# Altium project NODEBOX-RF868.PrjPcb
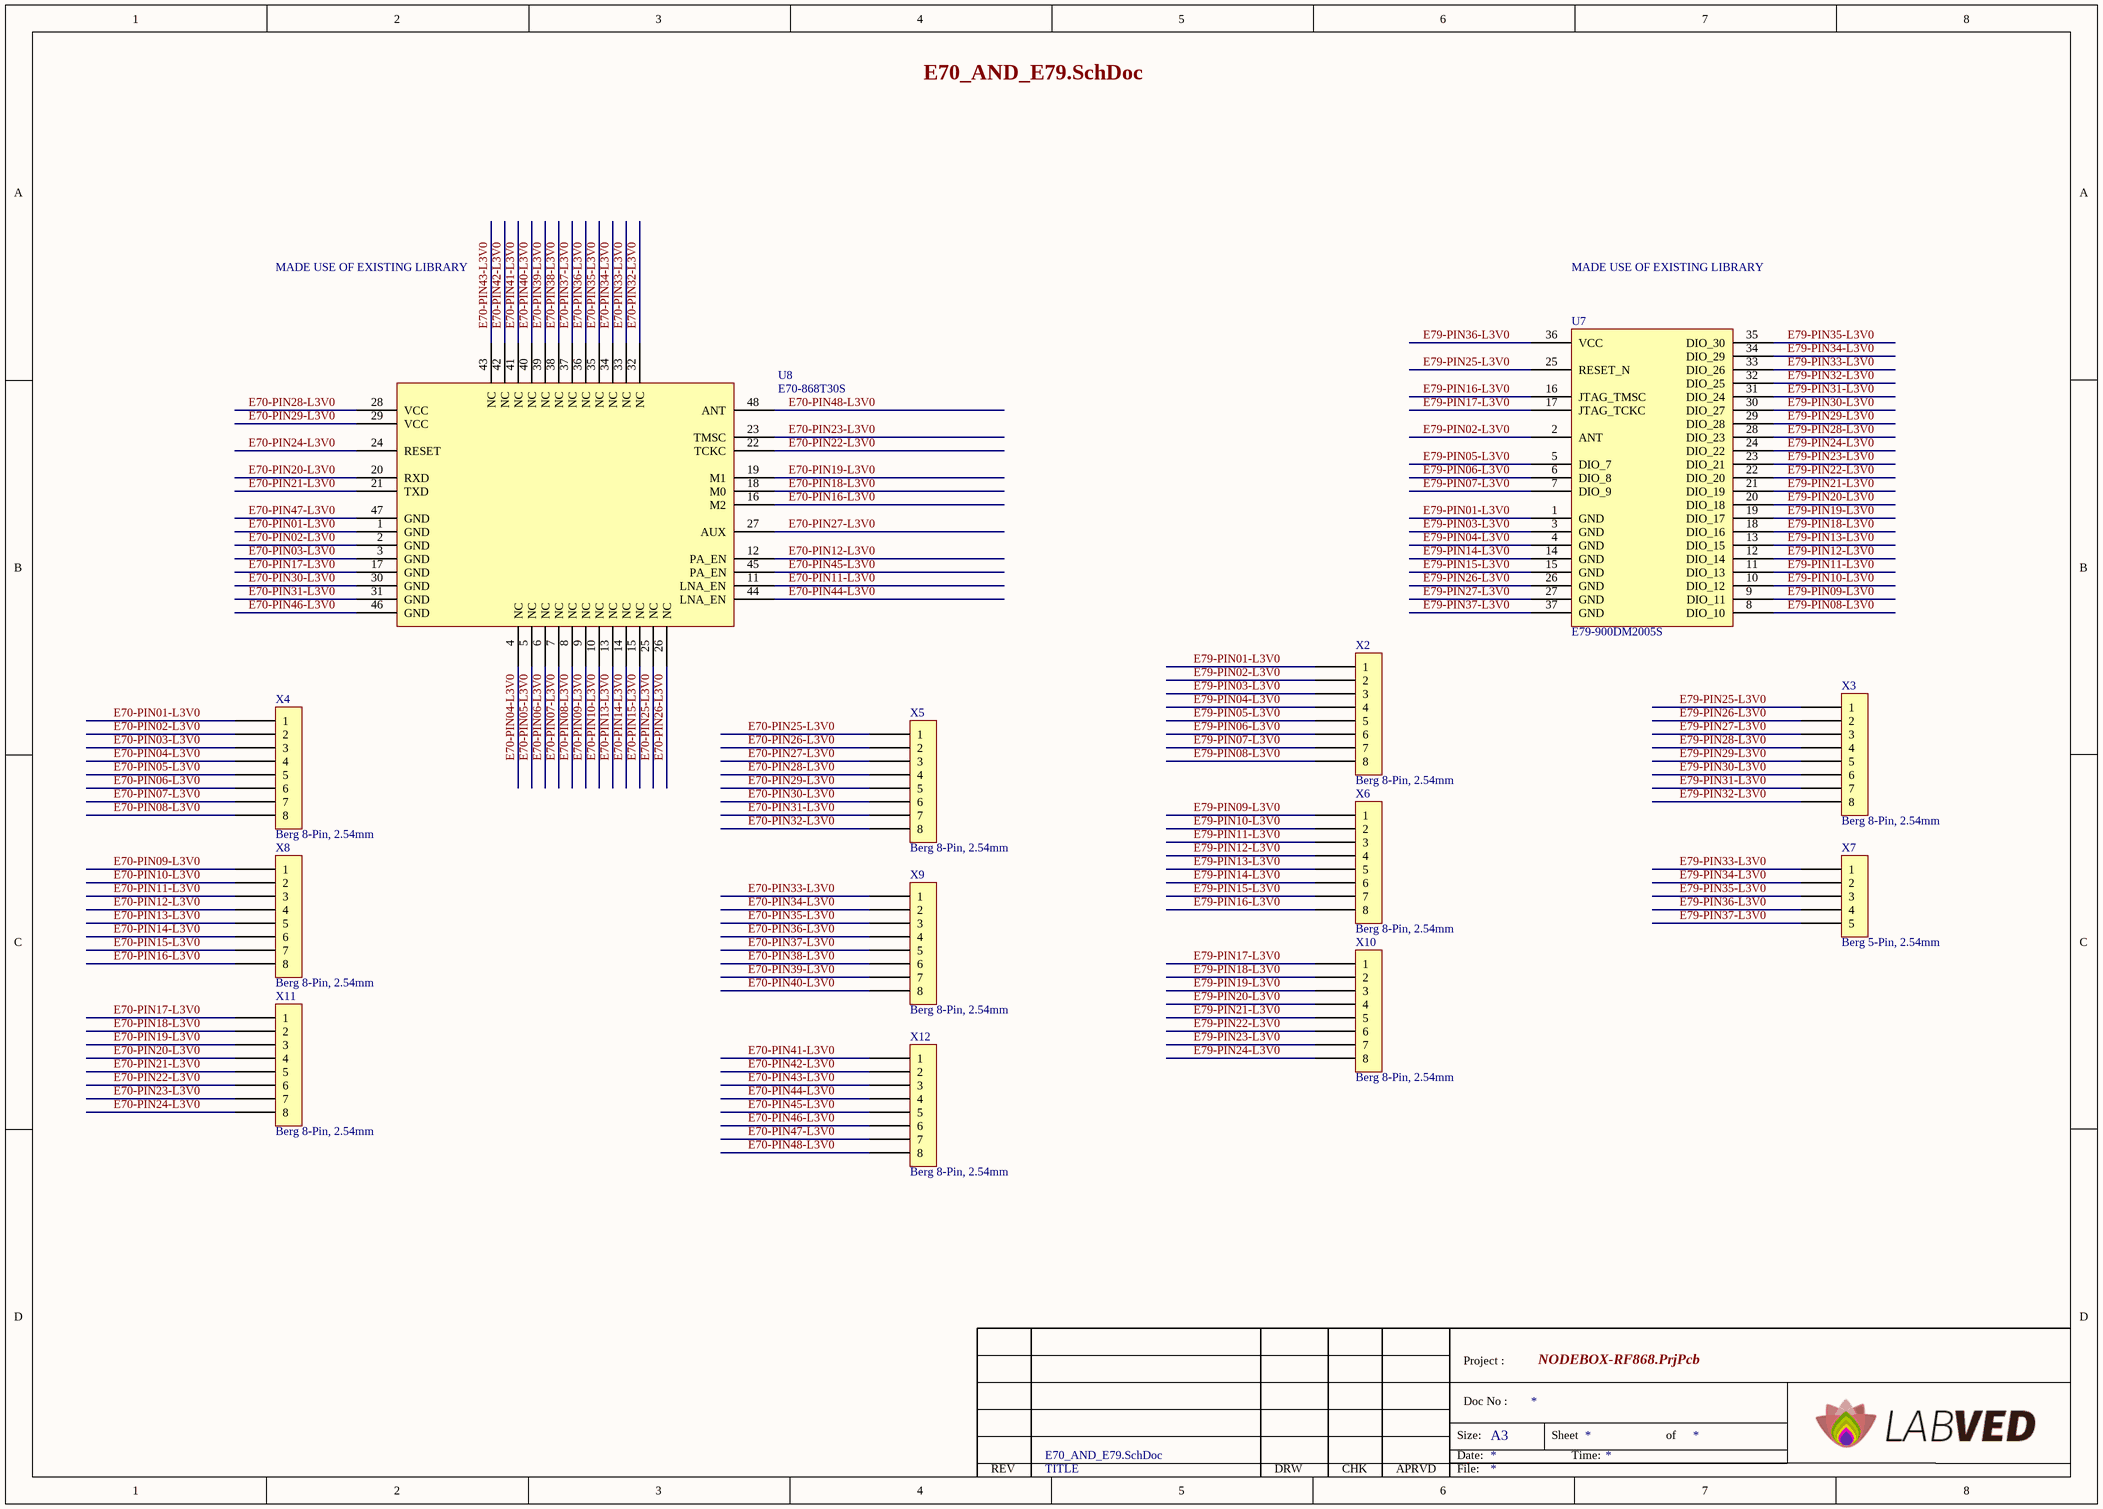
[diagram p0: E70_AND_E79.SchDoc]
1 sheet, 13 parts. Net scope: global (net labels, ports and power ports of the same name join across sheets).
Board file: BREAKOUT_BOARD.PcbDoc

## Sheet E70_AND_E79.SchDoc
size A3

### Parts
U7  E79-900DM2005S  [E79-900DM2005S]
U8  E70-868T30S  [E70-868T30S]
X2  Berg 8-Pin, 2.54mm  [Berg 8-Pin, 2.54MM]
X3  Berg 8-Pin, 2.54mm  [Berg 8-Pin, 2.54MM]
X4  Berg 8-Pin, 2.54mm  [Berg 8-Pin, 2.54MM]
X5  Berg 8-Pin, 2.54mm  [Berg 8-Pin, 2.54MM]
X6  Berg 8-Pin, 2.54mm  [Berg 8-Pin, 2.54MM]
X7  Berg 5-Pin, 2.54mm  [Berg 5-Pin, 2.54MM]
X8  Berg 8-Pin, 2.54mm  [Berg 8-Pin, 2.54MM]
X9  Berg 8-Pin, 2.54mm  [Berg 8-Pin, 2.54MM]
X10  Berg 8-Pin, 2.54mm  [Berg 8-Pin, 2.54MM]
X11  Berg 8-Pin, 2.54mm  [Berg 8-Pin, 2.54MM]
X12  Berg 8-Pin, 2.54mm  [Berg 8-Pin, 2.54MM]

### Nets
E70-PIN01-L3V0: U8.1(GND) X4.1
E70-PIN02-L3V0: U8.2(GND) X4.2
E70-PIN03-L3V0: U8.3(GND) X4.3
E70-PIN04-L3V0: U8.4(NC) X4.4
E70-PIN05-L3V0: U8.5(NC) X4.5
E70-PIN06-L3V0: U8.6(NC) X4.6
E70-PIN07-L3V0: U8.7(NC) X4.7
E70-PIN08-L3V0: U8.8(NC) X4.8
E70-PIN09-L3V0: U8.9(NC) X8.1
E70-PIN10-L3V0: U8.10(NC) X8.2
E70-PIN11-L3V0: U8.11(LNA_EN) X8.3
E70-PIN12-L3V0: U8.12(PA_EN) X8.4
E70-PIN13-L3V0: U8.13(NC) X8.5
E70-PIN14-L3V0: U8.14(NC) X8.6
E70-PIN15-L3V0: U8.15(NC) X8.7
E70-PIN16-L3V0: U8.16(M2) X8.8
E70-PIN17-L3V0: U8.17(GND) X11.1
E70-PIN18-L3V0: U8.18(M0) X11.2
E70-PIN19-L3V0: U8.19(M1) X11.3
E70-PIN20-L3V0: U8.20(RXD) X11.4
E70-PIN21-L3V0: U8.21(TXD) X11.5
E70-PIN22-L3V0: U8.22(TCKC) X11.6
E70-PIN23-L3V0: U8.23(TMSC) X11.7
E70-PIN24-L3V0: U8.24(RESET) X11.8
E70-PIN25-L3V0: U8.25(NC) X5.1
E70-PIN26-L3V0: U8.26(NC) X5.2
E70-PIN27-L3V0: U8.27(AUX) X5.3
E70-PIN28-L3V0: U8.28(VCC) X5.4
E70-PIN29-L3V0: U8.29(VCC) X5.5
E70-PIN30-L3V0: U8.30(GND) X5.6
E70-PIN31-L3V0: U8.31(GND) X5.7
E70-PIN32-L3V0: U8.32(NC) X5.8
E70-PIN33-L3V0: U8.33(NC) X9.1
E70-PIN34-L3V0: U8.34(NC) X9.2
E70-PIN35-L3V0: U8.35(NC) X9.3
E70-PIN36-L3V0: U8.36(NC) X9.4
E70-PIN37-L3V0: U8.37(NC) X9.5
E70-PIN38-L3V0: U8.38(NC) X9.6
E70-PIN39-L3V0: U8.39(NC) X9.7
E70-PIN40-L3V0: U8.40(NC) X9.8
E70-PIN41-L3V0: U8.41(NC) X12.1
E70-PIN42-L3V0: U8.42(NC) X12.2
E70-PIN43-L3V0: U8.43(NC) X12.3
E70-PIN44-L3V0: U8.44(LNA_EN) X12.4
E70-PIN45-L3V0: U8.45(PA_EN) X12.5
E70-PIN46-L3V0: U8.46(GND) X12.6
E70-PIN47-L3V0: U8.47(GND) X12.7
E70-PIN48-L3V0: U8.48(ANT) X12.8
E79-PIN01-L3V0: U7.1(GND) X2.1
E79-PIN02-L3V0: U7.2(ANT) X2.2
E79-PIN03-L3V0: U7.3(GND) X2.3
E79-PIN04-L3V0: U7.4(GND) X2.4
E79-PIN05-L3V0: U7.5(DIO_7) X2.5
E79-PIN06-L3V0: U7.6(DIO_8) X2.6
E79-PIN07-L3V0: U7.7(DIO_9) X2.7
E79-PIN08-L3V0: U7.8(DIO_10) X2.8
E79-PIN09-L3V0: U7.9(DIO_11) X6.1
E79-PIN10-L3V0: U7.10(DIO_12) X6.2
E79-PIN11-L3V0: U7.11(DIO_13) X6.3
E79-PIN12-L3V0: U7.12(DIO_14) X6.4
E79-PIN13-L3V0: U7.13(DIO_15) X6.5
E79-PIN14-L3V0: U7.14(GND) X6.6
E79-PIN15-L3V0: U7.15(GND) X6.7
E79-PIN16-L3V0: U7.16(JTAG_TMSC) X6.8
E79-PIN17-L3V0: U7.17(JTAG_TCKC) X10.1
E79-PIN18-L3V0: U7.18(DIO_16) X10.2
E79-PIN19-L3V0: U7.19(DIO_17) X10.3
E79-PIN20-L3V0: U7.20(DIO_18) X10.4
E79-PIN21-L3V0: U7.21(DIO_19) X10.5
E79-PIN22-L3V0: U7.22(DIO_20) X10.6
E79-PIN23-L3V0: U7.23(DIO_21) X10.7
E79-PIN24-L3V0: U7.24(DIO_22) X10.8
E79-PIN25-L3V0: U7.25(RESET_N) X3.1
E79-PIN26-L3V0: U7.26(GND) X3.2
E79-PIN27-L3V0: U7.27(GND) X3.3
E79-PIN28-L3V0: U7.28(DIO_23) X3.4
E79-PIN29-L3V0: U7.29(DIO_28) X3.5
E79-PIN30-L3V0: U7.30(DIO_27) X3.6
E79-PIN31-L3V0: U7.31(DIO_24) X3.7
E79-PIN32-L3V0: U7.32(DIO_25) X3.8
E79-PIN33-L3V0: U7.33(DIO_26) X7.1
E79-PIN34-L3V0: U7.34(DIO_29) X7.2
E79-PIN35-L3V0: U7.35(DIO_30) X7.3
E79-PIN36-L3V0: U7.36(VCC) X7.4
E79-PIN37-L3V0: U7.37(GND) X7.5

### Notes on the sheet
- MADE USE OF EXISTING LIBRARY
- Project :
- Size:
- Date:
- Doc No :
- A3
- Sheet
- Time:
- of
- REV
- TITLE
- DRW
- CHK
- APRVD
- File:

### Library data of the parts
U7 = CMP-ROOT-0001-1: LORA MODULE
U8 = CMP-ROOT-0002-4: WIRELESS LORA MODULE
X2-X6 X8-X12 = CMP-003-0075-1: Berg 8-Pin, 2.54mm pitch; Design Item ID: Berg 8-Pin, 2.54mm; Source: Headers.SchLib
X7 = CMP-003-0073-1: Berg 5-Pin, 2.54mm pitch; Source: Headers.SchLib; Design Item ID: Berg 5-Pin, 2.54mm